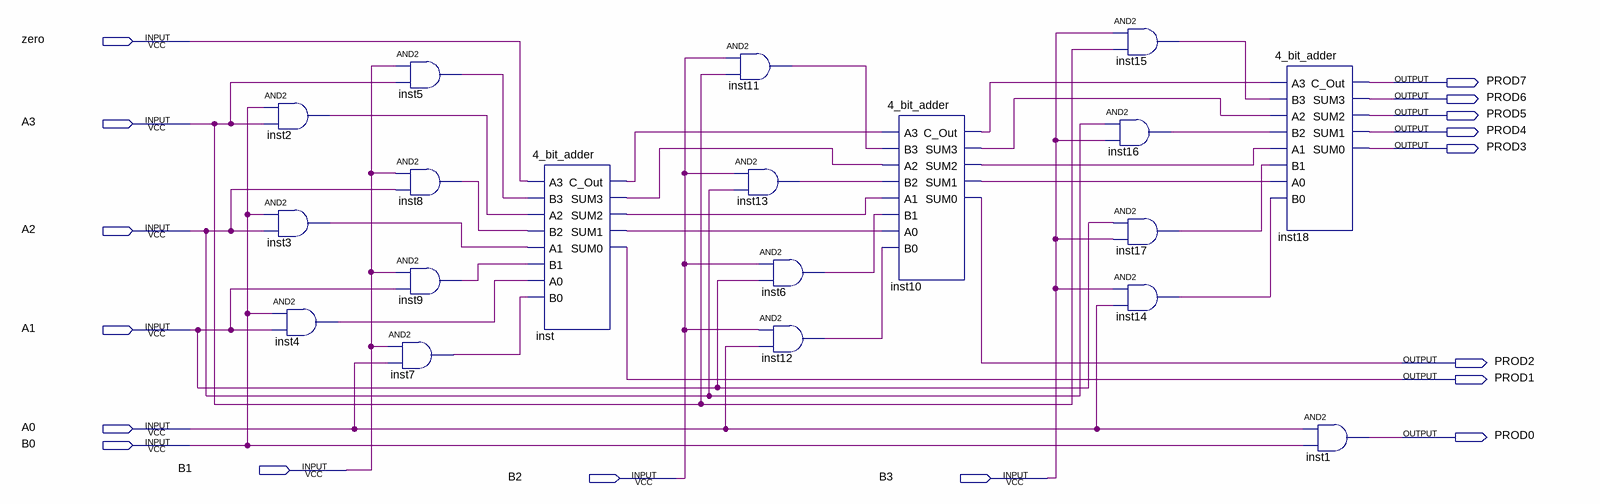
[diagram p0: schematic sheet]
// Quartus schematic 4_bit_Multiplier.bdf as structural Verilog: 19 symbols, 17 pins
module \4_bit_Multiplier  (
  input  zero,
  input  A3,
  input  A2,
  input  A1,
  input  A0,
  input  B0,
  input  B1,
  input  B2,
  input  B3,
  output PROD7,
  output PROD6,
  output PROD5,
  output PROD4,
  output PROD3,
  output PROD2,
  output PROD1,
  output PROD0
);

  wire inst2_out, inst3_out, inst4_out, inst5_out, inst6_out, inst7_out, inst8_out, inst9_out, inst10_c_out,
       inst10_sum1, inst10_sum2, inst10_sum3, inst11_out, inst12_out, inst13_out, inst14_out, inst15_out,
       inst16_out, inst17_out, inst_c_out, inst_sum1, inst_sum2, inst_sum3;

  and inst2 (inst2_out, B0, A3);
  and inst3 (inst3_out, B0, A2);
  and inst4 (inst4_out, B0, A1);
  and inst5 (inst5_out, B1, A3);
  and inst8 (inst8_out, B1, A2);
  and inst9 (inst9_out, B1, A1);
  and inst7 (inst7_out, B1, A0);
  \4_bit_adder  inst (
    .A3(zero), .B3(inst5_out), .A2(inst2_out), .B2(inst8_out), .A1(inst3_out), .B1(inst9_out),
    .A0(inst4_out), .B0(inst7_out), .C_Out(inst_c_out), .SUM3(inst_sum3), .SUM2(inst_sum2), .SUM1(inst_sum1),
    .SUM0(PROD1));
  and inst11 (inst11_out, B2, A3);
  and inst13 (inst13_out, B2, A2);
  and inst6 (inst6_out, B2, A1);
  and inst12 (inst12_out, B2, A0);
  \4_bit_adder  inst10 (
    .A3(inst_c_out), .B3(inst11_out), .A2(inst_sum3), .B2(inst13_out), .A1(inst_sum2), .B1(inst6_out),
    .A0(inst_sum1), .B0(inst12_out), .C_Out(inst10_c_out), .SUM3(inst10_sum3), .SUM2(inst10_sum2),
    .SUM1(inst10_sum1), .SUM0(PROD2));
  and inst15 (inst15_out, B3, A3);
  and inst16 (inst16_out, A2, B3);
  and inst17 (inst17_out, A1, B3);
  and inst14 (inst14_out, B3, A0);
  \4_bit_adder  inst18 (
    .A3(inst10_c_out), .B3(inst15_out), .A2(inst10_sum3), .B2(inst16_out), .A1(inst10_sum2), .B1(inst17_out),
    .A0(inst10_sum1), .B0(inst14_out), .C_Out(PROD7), .SUM3(PROD6), .SUM2(PROD5), .SUM1(PROD4), .SUM0(PROD3));
  and inst1 (PROD0, A0, B0);
endmodule
